# Altium schematic sheet S7_Misc.SchDoc
size A3
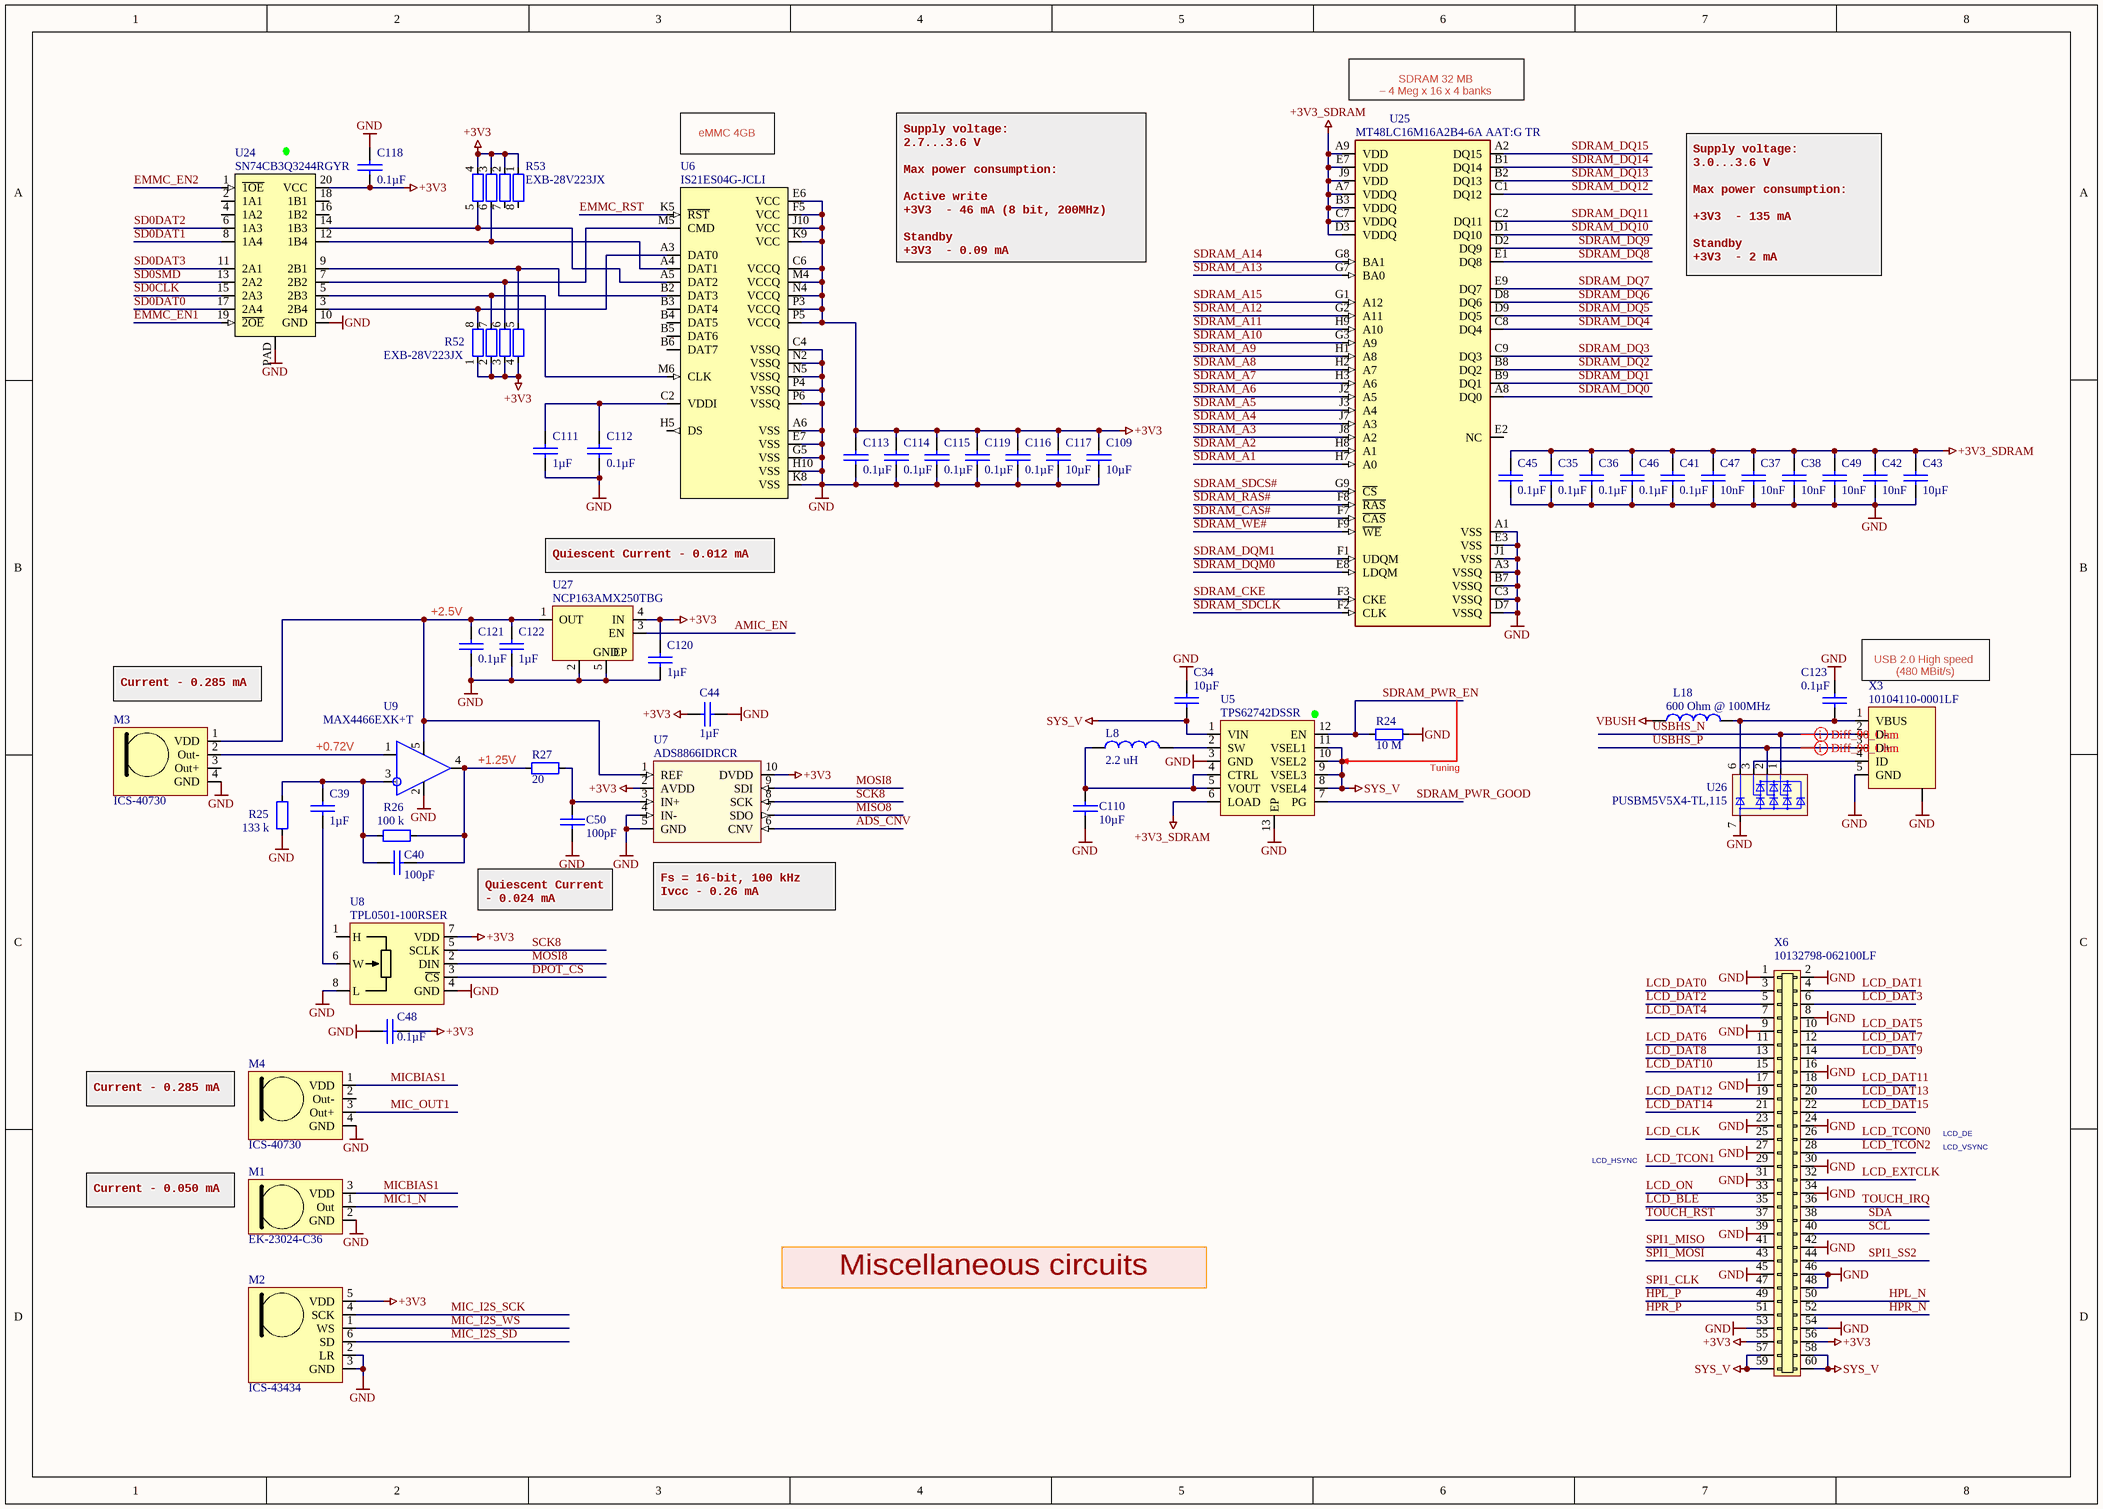
[diagram p0: S7_Misc.SchDoc]

## Parts
C34  value 10µF  [0603 CAP]  (hidden comment: Capacitor)
C35  value 0.1µF  [0402 CAP]  (hidden comment: Capacitor)
C36  value 0.1µF  [0402 CAP]  (hidden comment: Capacitor)
C37  value 10nF  [0402 CAP]  (hidden comment: Capacitor)
C38  value 10nF  [0402 CAP]  (hidden comment: Capacitor)
C39  value 1µF  [0402 CAP]  (hidden comment: Capacitor)
C40  value 100pF  [0402 CAP]  (hidden comment: Capacitor)
C41  value 0.1µF  [0402 CAP]  (hidden comment: Capacitor)
C42  value 10nF  [0402 CAP]  (hidden comment: Capacitor)
C43  value 10µF  [0603 CAP]  (hidden comment: Capacitor)
C44  value 1µF  [0402 CAP]  (hidden comment: Capacitor)
C45  value 0.1µF  [0402 CAP]  (hidden comment: Capacitor)
C46  value 0.1µF  [0402 CAP]  (hidden comment: Capacitor)
C47  value 10nF  [0402 CAP]  (hidden comment: Capacitor)
C48  value 0.1µF  [0402 CAP]  (hidden comment: Capacitor)
C49  value 10nF  [0402 CAP]  (hidden comment: Capacitor)
C50  value 100pF  [0402 CAP]  (hidden comment: Capacitor)
C109  value 10µF  [0603 CAP]  (hidden comment: Capacitor)
C110  value 10µF  [0603 CAP]  (hidden comment: Capacitor)
C111  value 1µF  [0402 CAP]  (hidden comment: Capacitor)
C112  value 0.1µF  [0402 CAP]  (hidden comment: Capacitor)
C113  value 0.1µF  [0402 CAP]  (hidden comment: Capacitor)
C114  value 0.1µF  [0402 CAP]  (hidden comment: Capacitor)
C115  value 0.1µF  [0402 CAP]  (hidden comment: Capacitor)
C116  value 0.1µF  [0402 CAP]  (hidden comment: Capacitor)
C117  value 10µF  [0603 CAP]  (hidden comment: Capacitor)
C118  value 0.1µF  [0402 CAP]  (hidden comment: Capacitor)
C119  value 0.1µF  [0402 CAP]  (hidden comment: Capacitor)
C120  value 1µF  [0402 CAP]  (hidden comment: Capacitor)
C121  value 0.1µF  [0402 CAP]  (hidden comment: Capacitor)
C122  value 1µF  [0402 CAP]  (hidden comment: Capacitor)
C123  value 0.1µF  [0402 CAP]  (hidden comment: Capacitor)
L8  value 2.2 uH  [744025002]  (hidden comment: 744025002)
L18  value 600 Ohm @ 100MHz  [0805]  (hidden comment: MPZ2012S601AT000)
M1  EK-23024-C36  [EK-23024-C36]
M2  ICS-43434  [ICS-43434]
M3  ICS-40730  [ICS-40730]
M4  ICS-40730  [ICS-40730]
R24  value 10 M  [0402]  (hidden comment: Resistor)
R25  value 133 k  [0402]  (hidden comment: Resistor)
R26  value 100 k  [0402]  (hidden comment: Resistor)
R27  value 20  [0402]  (hidden comment: Resistor)
R52  EXB-28V223JX  [EXB28V 2x1 mm]
R53  EXB-28V223JX  [EXB28V 2x1 mm]
U5  TPS62742DSSR  [12-WSON]
U6  IS21ES04G-JCLI  [MICRON_WFBGA153]
U7  ADS8866IDRCR  [TI S-PVSON-N10]
U8  TPL0501-100RSER  [UQFN-8]
U9  MAX4466EXK+T  [SOT-353 ON Semi]
U24  SN74CB3Q3244RGYR  [TI_PVQFN-N20]
U25  MT48LC16M16A2B4-6A AAT:G TR  [MICRON_VFBGA54]
U26  PUSBM5V5X4-TL,115  [DFN1616-6]
U27  NCP163AMX250TBG  [4-XDFN]
X3  10104110-0001LF  [FCI micro USB B receptacle SMD]
X6  10132798-062100LF  [10132798-062100LF]

## Nets
+3V3: C44.1 C48.2 C109.1 C113.1 C114.1 C115.1 C116.1 C117.1 C118.2 C119.1 C120.1 M2.5(VDD) R52.1 R52.2 R52.3 R52.4 R53.1 R53.2 R53.3 R53.4 U6.C6(VCCQ) U6.E6(VCC) U6.F5(VCC) U6.J10(VCC) U6.K9(VCC) U6.M4(VCCQ) U6.N4(VCCQ) U6.P3(VCCQ) U6.P5(VCCQ) U7.2(AVDD) U7.10(DVDD) U8.7(VDD) U24.20(VCC) U27.4(IN) X6.55 X6.56
+3V3_SDRAM: C35.1 C36.1 C37.1 C38.1 C41.1 C42.1 C43.1 C45.1 C46.1 C47.1 C49.1 U5.6(LOAD) U25.A7(VDDQ) U25.A9(VDD) U25.B3(VDDQ) U25.C7(VDDQ) U25.D3(VDDQ) U25.E7(VDD) U25.J9(VDD)
GND: C34.1 C35.2 C36.2 C37.2 C38.2 C41.2 C42.2 C43.2 C44.2 C45.2 C46.2 C47.2 C48.1 C49.2 C50.1 C109.2 C110.1 C111.2 C112.2 C113.2 C114.2 C115.2 C116.2 C117.2 C118.1 C119.2 C120.2 C121.2 C122.2 C123.1 M1.2(GND) M2.2(LR) M2.3(GND) M3.4(GND) M4.4(GND) R24.2 R25.1 U5.3(GND) U5.13(EP) U6.A6(VSS) U6.C4(VSSQ) U6.E7(VSS) U6.G5(VSS) U6.H10(VSS) U6.K8(VSS) U6.N2(VSSQ) U6.N5(VSSQ) U6.P4(VSSQ) U6.P6(VSSQ) U7.4(IN-) U7.5(GND) U8.4(GND) U8.8(L) U9.2(GND) U24.10(GND) U24.PAD U25.A1(VSS) U25.A3(VSSQ) U25.B7(VSSQ) U25.C3(VSSQ) U25.D7(VSSQ) U25.E3(VSS) U25.J1(VSS) U26.7 U27.2(GND) U27.5(EP) X3.5(GND) X3.G1(CASE) X6.1 X6.2 X6.8 X6.9 X6.16 X6.17 X6.23 X6.24 X6.27 X6.30 X6.31 X6.34 X6.39 X6.42 X6.45 X6.46 X6.48 X6.53 X6.54
SYS_V: C34.2 U5.1(VIN) U5.8(VSEL4) U5.9(VSEL3) U5.10(VSEL2) U5.11(VSEL1) X6.57 X6.58 X6.59 X6.60
VBUSH: L18.2
ADS_CNV: U7.6(CNV)
AMIC_EN: U27.3(EN)
DPOT_CS: U8.3(~{CS})
EMMC_EN1: U24.19(~{2OE})
EMMC_EN2: U24.1(~{1OE})
EMMC_RST: U6.K5(~{RST})
HPL_N: X6.50
HPL_P: X6.49
HPR_N: X6.52
HPR_P: X6.51
LCD_BLE: X6.35
LCD_CLK: X6.25
LCD_DAT0: X6.3
LCD_DAT1: X6.4
LCD_DAT2: X6.5
LCD_DAT3: X6.6
LCD_DAT4: X6.7
LCD_DAT5: X6.10
LCD_DAT6: X6.11
LCD_DAT7: X6.12
LCD_DAT8: X6.13
LCD_DAT9: X6.14
LCD_DAT10: X6.15
LCD_DAT11: X6.18
LCD_DAT12: X6.19
LCD_DAT13: X6.20
LCD_DAT14: X6.21
LCD_DAT15: X6.22
LCD_EXTCLK: X6.32
LCD_ON: X6.33
LCD_TCON0: X6.26
LCD_TCON1: X6.29
LCD_TCON2: X6.28
MIC1_N: M1.1(Out)
MIC_I2S_SCK: M2.4(SCK)
MIC_I2S_SD: M2.6(SD)
MIC_I2S_WS: M2.1(WS)
MIC_OUT1: M4.3(Out+)
MICBIAS1: M1.3(VDD) M4.1(VDD)
MISO8: U7.7(SDO)
MOSI8: U7.9(SDI) U8.2(DIN)
SCK8: U7.8(SCK) U8.5(SCLK)
SCL: X6.40
SD0CLK: U24.15(2A3)
SD0DAT0: U24.17(2A4)
SD0DAT1: U24.8(1A4)
SD0DAT2: U24.6(1A3)
SD0DAT3: U24.11(2A1)
SD0SMD: U24.13(2A2)
SDA: X6.38
SDRAM_A1: U25.H7(A0)
SDRAM_A2: U25.H8(A1)
SDRAM_A3: U25.J8(A2)
SDRAM_A4: U25.J7(A3)
SDRAM_A5: U25.J3(A4)
SDRAM_A6: U25.J2(A5)
SDRAM_A7: U25.H3(A6)
SDRAM_A8: U25.H2(A7)
SDRAM_A9: U25.H1(A8)
SDRAM_A10: U25.G3(A9)
SDRAM_A11: U25.H9(A10)
SDRAM_A12: U25.G2(A11)
SDRAM_A13: U25.G7(BA0)
SDRAM_A14: U25.G8(BA1)
SDRAM_A15: U25.G1(A12)
SDRAM_CAS#: U25.F7(~{CAS})
SDRAM_CKE: U25.F3(CKE)
SDRAM_DQ0: U25.A8(DQ0)
SDRAM_DQ1: U25.B9(DQ1)
SDRAM_DQ2: U25.B8(DQ2)
SDRAM_DQ3: U25.C9(DQ3)
SDRAM_DQ4: U25.C8(DQ4)
SDRAM_DQ5: U25.D9(DQ5)
SDRAM_DQ6: U25.D8(DQ6)
SDRAM_DQ7: U25.E9(DQ7)
SDRAM_DQ8: U25.E1(DQ8)
SDRAM_DQ9: U25.D2(DQ9)
SDRAM_DQ10: U25.D1(DQ10)
SDRAM_DQ11: U25.C2(DQ11)
SDRAM_DQ12: U25.C1(DQ12)
SDRAM_DQ13: U25.B2(DQ13)
SDRAM_DQ14: U25.B1(DQ14)
SDRAM_DQ15: U25.A2(DQ15)
SDRAM_DQM0: U25.E8(LDQM)
SDRAM_DQM1: U25.F1(UDQM)
SDRAM_PWR_EN: R24.1 U5.12(EN)
SDRAM_PWR_GOOD: U5.7(PG)
SDRAM_RAS#: U25.F8(~{RAS})
SDRAM_SDCLK: U25.F2(CLK)
SDRAM_SDCS#: U25.G9(~{CS})
SDRAM_WE#: U25.F9(~{WE})
SPI1_CLK: X6.47
SPI1_MISO: X6.41
SPI1_MOSI: X6.43
SPI1_SS2: X6.44
TOUCH_IRQ: X6.36
TOUCH_RST: X6.37
USBHS_N: U26.1 X3.2(D-)
USBHS_P: U26.2 X3.3(D+)
NetC39_1: C39.1 C40.1 R25.2 R26.1 U9.3(IN-)
NetC39_2: C39.2 U8.6(W)
NetC40_2: C40.2 R26.2 R27.1 U9.4(OUT)
NetC50_2: C50.2 R27.2 U7.3(IN+)
NetC110_2: C110.2 L8.1 U5.4(CTRL) U5.5(VOUT)
NetC111_1: C111.1 C112.1 U6.C2(VDDI)
NetC121_1: C121.1 C122.1 M3.1(VDD) U7.1(REF) U9.5(VCC) U27.1(OUT)
NetC123_2: C123.2 L18.1 U26.6 X3.1(VBUS)
NetL8_2: L8.2 U5.2(SW)
NetM3_2: M3.2(Out-) U9.1(IN+)
NetR52_5: R52.5 U6.B2(DAT3) U24.9(2B1)
NetR52_6: R52.6 U6.M5(CMD) U24.7(2B2)
NetR52_7: R52.7 U6.M6(CLK) U24.5(2B3)
NetR52_8: R52.8 U6.A3(DAT0) U24.3(2B4)
NetR53_5: R53.5 U6.A5(DAT2) U24.14(1B3)
NetR53_6: R53.6 U6.A4(DAT1) U24.12(1B4)
NetU26_3: U26.3 X3.4(ID)

Not connected (* = marked no-connect by the designer): M3 3(Out+); M4 2(Out-); R53 7 8; U6 B3(DAT4) B4(DAT5) B5(DAT6) B6(DAT7) H5(DS); U8 1(H); U24 2(1A1) 4(1A2) 16(1B2) 18(1B1); U25 E2(NC)

## Layout directives
differential pair; rule Differential Pairs Routing [Pref Gap = 0.127mm    Min Gap  = 0.127mm    Max Gap  = 0.127mmPref Width = 0.138mm    Min Width  = 0.075mm    Max Width  = 0.138mm]: USBHS_N, USBHS_P

## Notes on the sheet
- SDRAM 32 MB
  – 4 Meg x 16 x 4 banks
- (near U6) eMMC 4GB
- Supply voltage:
  2.7...3.6 V
  Max power consumption:
  Active write
  +3V3  - 46 mA (8 bit, 200MHz)
  Standby
  +3V3  - 0.09 mA
- Supply voltage:
  3.0...3.6 V
  Max power consumption:
  +3V3  - 135 mA
  Standby
  +3V3  - 2 mA
- Quiescent Current - 0.012 mA
- (near C121) +2.5V
- (near M3) Current - 0.285 mA
- USB 2.0 High speed
  (480 MBit/s)
- +0.72V
- +1.25V
- (near R24) Tuning
- Quiescent Current - 0.024 mA
- (near U7) Fs = 16-bit, 100 kHz
  Ivcc - 0.26 mA
- Current - 0.285 mA
- LCD_HSYNC
- LCD_VSYNC
- LCD_DE
- Current - 0.050 mA
- Miscellaneous circuits

## Library data of the parts
C34 C43 C109 C110 C117 = GRT188R61C106KE13D: 10µF, ±10%, 16V, X5R, 0603 (1608 Metric), -55°C ~ 85°C, -, Automotive; Manufacturer: Murata Electronics North America; PartNum: 490-12317-1-ND; Voltage - Rated: 16V; Part Number: GRT188R61C106KE13D; Distributor: Digi-Key; PartName: GRT188R61C106KE13D; Price: 0.22770; Tolerance: ±10%; Temperature Coefficient: X5R; Operating Temperature: -55°C ~ 85°C; Features: -; Package / Case: 0603 (1608 Metric)
C35 C36 C41 C45 C46 C48 C112-C116 C118 C119 C121 C123 = 0402B104K500CT: 0.1µF, ±10%, 50V, X7R, 0402 (1005 Metric), -55°C ~ 125°C, -, General Purpose; Manufacturer: Walsin Technology Corporation; PartNum: 1292-1176-1-ND; Voltage - Rated: 50V; Part Number: 0402B104K500CT; Distributor: Digi-Key; PartName: 0402B104K500CT; Price: 0.19000; Tolerance: ±10%; Temperature Coefficient: X7R; Operating Temperature: -55°C ~ 125°C; Features: -; Package / Case: 0402 (1005 Metric)
C37 C38 C42 C47 C49 = CL05B103KB5NNNC: 10000pF, ±10%, 50V, X7R, 0402 (1005 Metric), -55°C ~ 125°C, -, General Purpose; Manufacturer: Samsung Electro-Mechanics; PartNum: 1276-1028-1-ND; Voltage - Rated: 50V; Part Number: CL05B103KB5NNNC; Distributor: Digi-Key; PartName: CL05B103KB5NNNC; Price: 0.10000; Tolerance: ±10%; Temperature Coefficient: X7R; Operating Temperature: -55°C ~ 125°C; Features: -; Package / Case: 0402 (1005 Metric)
C39 C44 C111 C120 C122 = TMK105BJ105MV-F: 1µF, ±20%, 25V, X5R, 0402 (1005 Metric), -55°C ~ 85°C, -, General Purpose; Manufacturer: Taiyo Yuden; PartNum: 587-3245-1-ND; Voltage - Rated: 25V; Part Number: TMK105BJ105MV-F; Distributor: Digi-Key; PartName: TMK105BJ105MV-F; Price: 0.22000; Tolerance: ±20%; Temperature Coefficient: X5R; Operating Temperature: -55°C ~ 85°C; Features: -; Package / Case: 0402 (1005 Metric)
C40 C50 = AC0402JRNPO9BN101: 100pF, ±5%, 50V, C0G, NP0, 0402 (1005 Metric), -55°C ~ 125°C, -, Automotive; Manufacturer: Yageo; PartNum: 311-3023-1-ND; Voltage - Rated: 50V; Part Number: AC0402JRNPO9BN101; Distributor: Digi-Key; PartName: AC0402JRNPO9BN101; Price: 0.10000; Tolerance: ±5%; Temperature Coefficient: C0G, NP0; Operating Temperature: -55°C ~ 125°C; Features: -; Package / Case: 0402 (1005 Metric)
L8 = 744025002: Inductors 2.2 uH, 1.8 A, 0.066 Ohms, ±20% -40°C ~ 125°C, 2.8 x 2.8 mm; Manufacturer: Wurth Electronics Inc; PartNum: 732-2613-1-ND; Distributor: Digi-Key; Tolerance: ±20%; PartName: 744025002
L18 = MPZ2012S601AT000: FERRITE BEAD 600 OHM, 0805, -55°C ~ 125°C; Manufacturer: TDK Corporation; PartNum: 445-2206-1-ND; Distributor: Digi-Key; Price: 0.05$; PartName: MPZ2012S601AT000
M1 = EK-23024-C36: 100Hz ~ 5.5kHz Analog Microphone Electret Condenser 0.9V ~ 10V Omnidirectional (-53dB ±2dB @ 74dB SPL) Solder Pads; Manufacturer: Knowles; PartNum: 423-1121-ND; Distributor: Digi-Key; Price: 19.3$; PartName: EK-23024-C36
M2 = ICS-43434: 60Hz ~ 20kHz Digital, I²S Microphone MEMS (Silicon) 1.65V ~ 3.63V Omnidirectional (-26 ±1dB @ 94dB SPL) Solder Pads; Manufacturer: TDK InvenSense; PartNum: 1428-1066-1-ND; Distributor: Digi-Key; PartName: ICS-43434
M3 M4 = ICS-40730: 25Hz ~ 20kHz Analog Microphone MEMS (Silicon) 1.5V ~ 3.63V Noise Cancelling (-32dB ±2dB @ 124dB SPL) Solder Pads; Manufacturer: TDK InvenSense; PartNum: 1428-1141-1-ND; Distributor: Digi-Key; PartName: ICS-40730
R24 = CRCW040210M0FKEDC: 10 MOhms, ±1%, 0.063W, 1/16W, Thick Film, ±100ppm/°C, 0402 (1005 Metric), -55°C ~ 155°C, -; Manufacturer: Vishay Dale; PartNum: 541-4068-1-ND; Voltage: 75V; Distributor: Digi-Key; Price: 0.10000; Tolerance: ±1%; PartName: CRCW040210M0FKEDC; Part Number: CRCW040210M0FKEDC; Temperature Coefficient: ±100ppm/°C; Operating Temperature: -55°C ~ 155°C; Power (Watts): 0.063W, 1/16W; Features: -; Package / Case: 0402 (1005 Metric)
R25 = RMCF0402FT133K: 133 kOhms, ±1%, 0.063W, 1/16W, Thick Film, ±100ppm/°C, 0402 (1005 Metric), -55°C ~ 155°C, Automotive AEC-Q200; Manufacturer: Stackpole Electronics Inc; PartNum: RMCF0402FT133KCT-ND; Voltage: 75V; Distributor: Digi-Key; Price: 0.10000; Tolerance: ±1%; PartName: RMCF0402FT133K; Part Number: RMCF0402FT133K; Temperature Coefficient: ±100ppm/°C; Operating Temperature: -55°C ~ 155°C; Power (Watts): 0.063W, 1/16W; Features: Automotive AEC-Q200; Package / Case: 0402 (1005 Metric)
R26 = RMCF0402FT100K: 100 kOhms, ±1%, 0.063W, 1/16W, Thick Film, ±100ppm/°C, 0402 (1005 Metric), -55°C ~ 155°C, Automotive AEC-Q200; Manufacturer: Stackpole Electronics Inc; PartNum: RMCF0402FT100KCT-ND; Voltage: 75V; Distributor: Digi-Key; Price: 0.10000; Tolerance: ±1%; PartName: RMCF0402FT100K; Part Number: RMCF0402FT100K; Temperature Coefficient: ±100ppm/°C; Operating Temperature: -55°C ~ 155°C; Power (Watts): 0.063W, 1/16W; Features: Automotive AEC-Q200; Package / Case: 0402 (1005 Metric)
R27 = RMCF0402FT20R0: 20 Ohms, ±1%, 0.063W, 1/16W, Thick Film, ±100ppm/°C, 0402 (1005 Metric), -55°C ~ 155°C, Automotive AEC-Q200; Manufacturer: Stackpole Electronics Inc; PartNum: RMCF0402FT20R0CT-ND; Voltage: 75V; Distributor: Digi-Key; Price: 0.10000; Tolerance: ±1%; PartName: RMCF0402FT20R0; Part Number: RMCF0402FT20R0; Temperature Coefficient: ±100ppm/°C; Operating Temperature: -55°C ~ 155°C; Power (Watts): 0.063W, 1/16W; Features: Automotive AEC-Q200; Package / Case: 0402 (1005 Metric)
R52 R53 = EXB-28V223JX: 22k Ohm ±5%,  4 Resistor, -55°C ~ 125°C,(2.00mm x 1.00mm); Manufacturer: Panasonic Electronic Components; PartNum: Y7223CT-ND; Distributor: Digi-Key; Price: 0.1$; Tolerance: 5%; Value: 22 k; PartName: EXB-28V223JX
U5 = TPS62742DSSR: DCDC 1.8-3.3V, 400mA , Iq=360nA, -40°C ~ 85°C, 12-WSON (3x2); Manufacturer: Texas Instruments; PartNum: 296-40852-1-ND; Distributor: Digi-Key; price: 1.93$; PartName: TPS62742DSSR
U6 = IS21ES04G-JCLI: 4GByte eMMC, 200MHz, 2.7V ~ 3.6V, 153-VFBGA (11.5x13),  -40°C ~ 85°C; Manufacturer: Integrated Silicon Solution Inc; Mfg Part Number: IS21ES04G-JCLI; Package: 153-VFBGA (11.5x13); Display Name: IS21ES04G-JCLI
U7 = ADS8866IDRCR: 16-bit ADC, 100k, Pseudo-Differential, Single Ended, 2.7..3.6V,  -40°C...85°C, 10-VSON; Manufacturer: Texas Instruments; PartNum: 296-39886-1-ND; Distributor: Digi-Key; PartName: ADS8866IDRCR
U8 = TPL0501-100RSER: Digital Potentiometer 100k Ohm 1 Circuit 256 Taps SPI Interface, -40°C ~ 125°C,  8-UQFN (1.5x1.5); Manufacturer: Texas Instruments; PartNum: 296-29585-1-ND; Distributor: Digi-Key; PartName: TPL0501-100RSER
U9 = MAX4466EXK+T: OpAmp, Class AB,  2.4V ~ 5.5V, -40°C ~ 85°C, SC-70-5; Manufacturer: Maxim Integrated; PartNum: MAX4466EXK+CT-ND; Distributor: Digi-Key; PartName: MAX4466EXK+T
U24 = SN74CB3Q3244RGYR: Bus Switch 4 x 1:1, 2.3V ~ 3.6V,  -40°C ~ 85°C, 20-VQFN (3.5x4.5); Manufacturer: Texas Instruments; PartNum: 296-19127-1-ND; Distributor: Digi-Key; PartName: SN74CB3Q3244RGYR; Price: 1.08$
U25 = MT48LC16M16A2B4-6A AAT:G TR: Micron SDRAM 256M-Bit 16Mx16, 3.3V, 167MHz, 5.4ns, -40°C ~ 105°C, 54-VFBGA (8x8); Manufacturer: Micron Technology Inc.; PartNum: 557-1932-1-ND; Distributor: Digi-Key; PartName: MT48LC16M16A2B4-6A AAT:G TR; Price: 10.7$; Supplier 1: Digi-Key; Supplier Part Number 1: 557-1932-1-ND
U26 = PUSBM5V5X4-TL,115: TVS DIODE 5.5VWM 12VC 6HXSON; Manufacturer: NXP Semiconductors; PartNum: 568-10921-1-ND; Distributor: Digi-Key; PartName: PUSBM5V5X4-TL,115
U27 = NCP163AMX250TBG: LDO 2.5V, 250 mA, Vin < 5.5V, Iq < 20uA, -40..+125 C,  4-XDFN (1x1); Manufacturer: ON Semiconductor; PartNum: NCP163AMX250TBGOSCT-ND; Price: 0.41$; Distributor: Digi-Key; PartName: NCP163AMX250TBG
X3 = 10104110-0001LF: USB - micro B USB 2.0 Receptacle Connector 5 Position Surface Mount, Right Angle; Manufacturer: Amphenol FCI; PartNum: 609-4052-1-ND; Distributor: Digi-Key; Price: 0.79$; PartName: 10104110-0001LF
X6 = 10132798-062100LF: 60 Position Connector Receptacle, Center Strip Contacts Surface Mount Gold, height 2.7 mm, pitch 0.5 mm; Manufacturer: Amphenol ICC (FCI); PartNum: 609-5230-1-ND; Distributor: Digi-Key; PartName: 10132798-062100LF